# EAGLE schematic Battery Monitor (EAGLE 9.1.3)
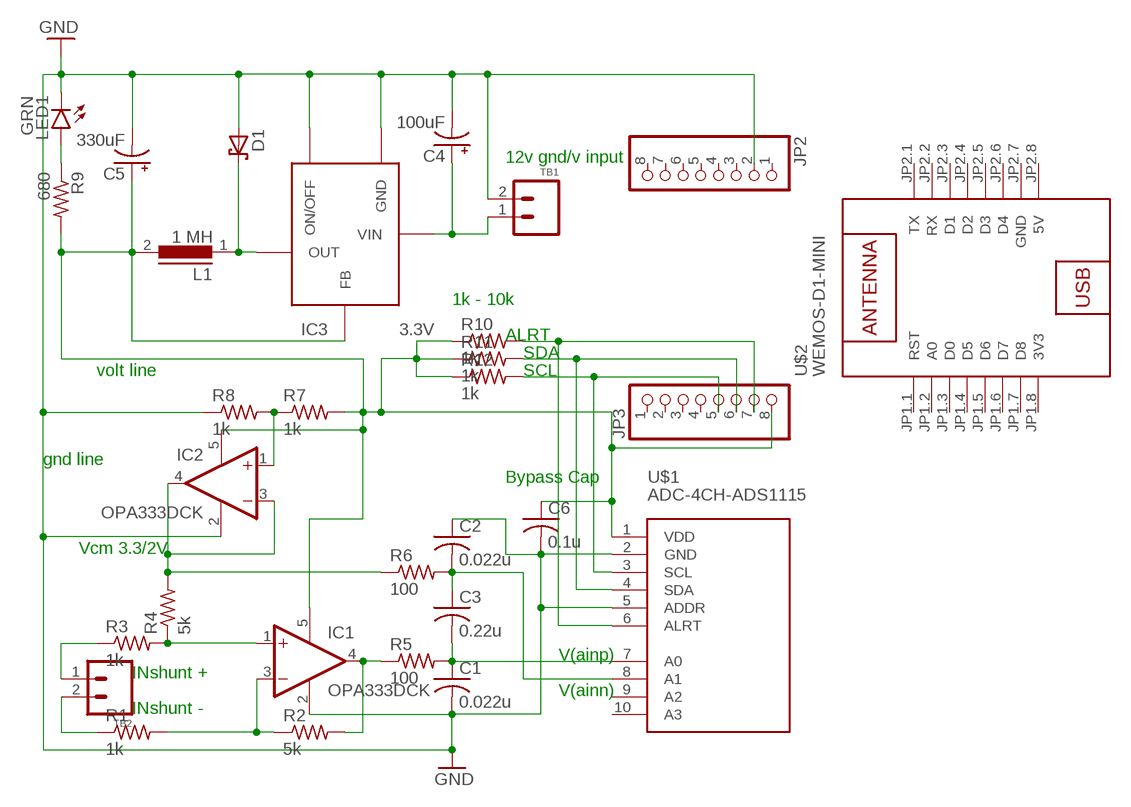
[diagram p0: schematic, sheet 1]

## Parts
C1  0.022u  CAP0603  [0603_CAP]
C2  0.022u  CAP0603  [0603_CAP]
C3  0.22u  CAP0603  [0603_CAP]
C4  100uF  CAP_POLF  [F_CAP]
C5  330uF  CAP_POLF  [F_CAP]
C6  0.1u  CAP0603  [0603_CAP]
D1  SCHOTTKY_DIODE  [SMD_DIODE]
IC1  OPA333DCK  [SC70-5L]
IC2  OPA333DCK  [SC70-5L]
IC3  3.3V  TL2575  [TO-263-5]
JP2  PINHD-1X8  [1X08]
JP3  PINHD-1X8  [1X08]
L1  1 MH  DR125  [DR125]
LED1  GRN  LED0603  [0603_LED]
R1  1k  RESISTOR0603  [0603_RESISTOR]
R2  5k  RESISTOR0603  [0603_RESISTOR]
R3  1k  RESISTOR0603  [0603_RESISTOR]
R4  5k  RESISTOR0603  [0603_RESISTOR]
R5  100  RESISTOR0603  [0603_RESISTOR]
R6  100  RESISTOR0603  [0603_RESISTOR]
R7  1k  RESISTOR0603  [0603_RESISTOR]
R8  1k  RESISTOR0603  [0603_RESISTOR]
R9  680  RESISTOR0603  [0603_RESISTOR]
R10  1k  RESISTOR0603  [0603_RESISTOR]
R11  1k  RESISTOR0603  [0603_RESISTOR]
R12  1k  RESISTOR0603  [0603_RESISTOR]
TB1  TERMINAL_BLOCK_2  [TERMINAL_BLOCK_2]
TB2  TERMINAL_BLOCK_2  [TERMINAL_BLOCK_2]
U$1  ADC-4CH-ADS1115  [ADC-4CH-ADS1115]
U$2  WEMOS-D1-MINI  [WEMOS-D1-MINI]

## Nets
GND: C1.2 C2.1 C4.- C5.- C6.2 D1.A IC1.2(V-) IC2.2(V-) IC3.3(GND) IC3.5(ON/OFF) JP2.2 LED1.C R8.1 TB1.2 U$1.2(GND) U$1.5(ADDR)
N$1: IC1.1(+IN) R3.2 R4.1
N$2: IC2.1(+IN) R7.1 R8.2
N$3: IC1.4(OUT) R2.2 R5.1
N$4: IC1.3(-IN) R1.2 R2.1
N$5: C1.1 C3.2 R5.2 U$1.7(A0)
N$6: C2.2 C3.1 R6.2 U$1.8(A1)
N$7: U$1.6(ALRT)
N$8: IC2.3(-IN) IC2.4(OUT) R4.2 R6.1
N$9: C4.+ IC3.1(VIN) TB1.1
N$10: R3.1 TB2.1
N$11: R1.1 TB2.2
N$12: JP3.7 R10.2
N$13: JP3.6 R11.2
N$14: JP3.5 R12.2
N$15: C5.+ C6.1 IC1.5(V+) IC2.5(V+) IC3.4(FB) JP3.8 L1.2 R7.2 R9.2 R10.1 R11.1 R12.1 U$1.1(VDD)
N$16: U$1.4(SDA)
N$17: U$1.3(SCL)
N$32: D1.C IC3.2(OUT) L1.1
N$38: LED1.A R9.1
Unconnected: JP2.1 JP2.3 JP2.4 JP2.5 JP2.6 JP2.7 JP2.8 JP3.1 JP3.2 JP3.3 JP3.4 U$1.9(A2) U$1.10(A3) U$2.JP1.1(RST) U$2.JP1.2(A0) U$2.JP1.3(D0) U$2.JP1.4(D5) U$2.JP1.5(D6) U$2.JP1.6(D7) U$2.JP1.7(D8) U$2.JP2.1(TX) U$2.JP2.2(RX) U$2.JP2.3(D1) U$2.JP2.4(D2) U$2.JP2.5(D3) U$2.JP2.6(D4)

## Notes on the sheet
- 12v gnd/v input
- 1k - 10k
- ALRT
- SDA
- volt line | SCL
- gnd line
- Bypass Cap
- Vcm 3.3/2V
- V(ainp)
- INshunt +
- V(ainn)
- INshunt -

## Power pins joined to a net without a drawn wire
3V3: U$2.JP1.8(3V3)
5V: U$2.JP2.8(5V)
GND: U$2.JP2.7(GND)

## Library data of the parts
C1-C3 C6 = jkf:CAP
C4 C5 = jkf:CAP_POL
D1 = jkf:SCHOTTKY_DIODE; DIGIKEY#: 1N5819HW-FDICT-ND; MANF: Diodes Inc; MANF#: 1N5819HW-7-F
IC1 IC2 = linear:OPA333: 1.8V, microPOWER CMOS OPERATIONAL AMPLIFIERS Zerø-Drift Series Source: Texas Instruments (Burr-Brown) .. U11 opa333 Operational Amp.pdf
IC3 = jkf:TL2575; DIGIKEY#: 296-21828-1-ND; MANF: Texas Instruments; MANF#: TL2575-33IKTTR
JP2 JP3 = pinhead:PINHD-1X8: PIN HEADER
L1 = jkf:DR125; DIGIKEY#: SRR1208-102KLCT-ND; MANF: Bourns Inc.; MANF#: SRR1208-102KL
LED1 = jkf:LED; DIGIKEY#: 516-2493-1-ND; MANF: Avago Technologies; MANF#: HSMG-C191
R1-R12 = jkf:RESISTOR
TB1 TB2 = jkf:TERMINAL_BLOCK_2; DIGIKEY#: 277-2072-1-ND; MANF: Phoenix; MANF#: 1771091
U$1 = diy-modules:ADC-4CH-ADS1115: 4 Channel 16-Bit Analog-to-Digital Converter based on ADS1115 chip Arduino ADS1115 Getting Started Tutorial is available here: http://henrysbench.capnfatz.com/henrys-bench/arduino-voltage-measurements/arduino-ads1115-module-getting-started-tutorial/ ADS1115 datasheet is available here: http://www.ti.com/lit/ds/symlink/ads1115.pdf Click here to find device on ebay.com <http://www.ebay.com/sch/ads1115+module>
U$2 = diy-modules:WEMOS-D1-MINI: WEMOS D1 mini: Mini Wi-Fi Board based on ESP-8266 device More details can be found here: https://www.wemos.cc/product/d1-mini.html Click here to find device on ebay.com <http://www.ebay.com/sch/wemos+d1+mini+nodemcu>